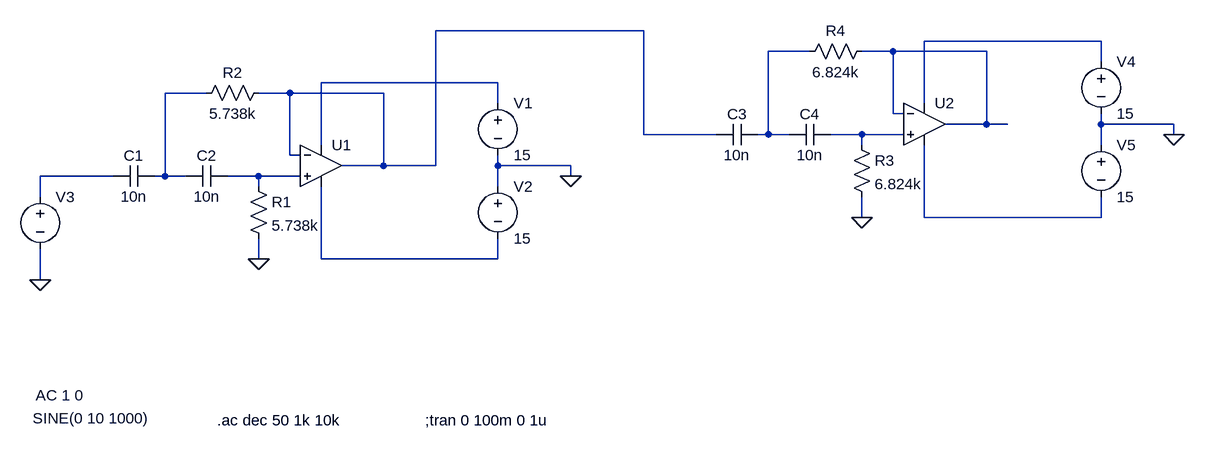
[diagram p0: schematic PA_teste.asc]
PA_teste.asc, the LTspice schematic file:
Version 4
SHEET 1 1556 680
WIRE 720 -32 400 -32
WIRE 1424 -16 1152 -16
WIRE 976 0 912 0
WIRE 1104 0 1056 0
WIRE 1248 0 1104 0
WIRE 1424 16 1424 -16
WIRE 496 48 224 48
WIRE 48 64 -16 64
WIRE 176 64 128 64
WIRE 320 64 176 64
WIRE 496 80 496 48
WIRE 1152 80 1152 -16
WIRE 1104 96 1104 0
WIRE 1120 96 1104 96
WIRE 1248 112 1248 0
WIRE 1248 112 1184 112
WIRE 1280 112 1248 112
WIRE 1424 112 1424 96
WIRE 1536 112 1424 112
WIRE 720 128 720 -32
WIRE 832 128 720 128
WIRE 912 128 912 0
WIRE 912 128 896 128
WIRE 944 128 912 128
WIRE 1056 128 1008 128
WIRE 1120 128 1056 128
WIRE 1536 128 1536 112
WIRE 224 144 224 48
WIRE 1056 144 1056 128
WIRE 1424 144 1424 112
WIRE 176 160 176 64
WIRE 192 160 176 160
WIRE 320 176 320 64
WIRE 320 176 256 176
WIRE 400 176 400 -32
WIRE 400 176 320 176
WIRE 496 176 496 160
WIRE 608 176 496 176
WIRE -96 192 -208 192
WIRE -16 192 -16 64
WIRE -16 192 -32 192
WIRE 16 192 -16 192
WIRE 128 192 80 192
WIRE 192 192 128 192
WIRE 608 192 608 176
WIRE 128 208 128 192
WIRE 496 208 496 176
WIRE -208 224 -208 192
WIRE 1056 256 1056 224
WIRE 1152 256 1152 144
WIRE 1424 256 1424 224
WIRE 1424 256 1152 256
WIRE 128 320 128 288
WIRE 224 320 224 208
WIRE 496 320 496 288
WIRE 496 320 224 320
WIRE -208 352 -208 304
FLAG 128 320 0
FLAG 608 192 0
FLAG -208 352 0
FLAG 1056 256 0
FLAG 1536 128 0
SYMBOL OpAmps\\UniversalOpAmp 224 176 R0
SYMATTR InstName U1
SYMBOL cap -32 176 R90
WINDOW 0 0 32 VBottom 2
WINDOW 3 32 32 VTop 2
SYMATTR InstName C1
SYMATTR Value 10n
SYMBOL cap 80 176 R90
WINDOW 0 0 32 VBottom 2
WINDOW 3 32 32 VTop 2
SYMATTR InstName C2
SYMATTR Value 10n
SYMBOL res 112 192 R0
SYMATTR InstName R1
SYMATTR Value 5.738k
SYMBOL res 144 48 R90
WINDOW 0 0 56 VBottom 2
WINDOW 3 32 56 VTop 2
SYMATTR InstName R2
SYMATTR Value 5.738k
SYMBOL voltage 496 64 R0
WINDOW 123 0 0 Left 0
WINDOW 39 0 0 Left 0
SYMATTR InstName V1
SYMATTR Value 15
SYMBOL voltage 496 192 R0
WINDOW 123 0 0 Left 0
WINDOW 39 0 0 Left 0
SYMATTR InstName V2
SYMATTR Value 15
SYMBOL voltage -208 208 R0
WINDOW 3 -12 357 Left 2
WINDOW 123 -7 322 Left 2
WINDOW 39 0 0 Left 0
SYMATTR Value SINE(0 10 1000)
SYMATTR Value2 AC 1 0
SYMATTR InstName V3
SYMBOL OpAmps\\UniversalOpAmp 1152 112 R0
SYMATTR InstName U2
SYMBOL cap 896 112 R90
WINDOW 0 0 32 VBottom 2
WINDOW 3 32 32 VTop 2
SYMATTR InstName C3
SYMATTR Value 10n
SYMBOL cap 1008 112 R90
WINDOW 0 0 32 VBottom 2
WINDOW 3 32 32 VTop 2
SYMATTR InstName C4
SYMATTR Value 10n
SYMBOL res 1040 128 R0
SYMATTR InstName R3
SYMATTR Value 6.824k
SYMBOL res 1072 -16 R90
WINDOW 0 0 56 VBottom 2
WINDOW 3 32 56 VTop 2
SYMATTR InstName R4
SYMATTR Value 6.824k
SYMBOL voltage 1424 0 R0
WINDOW 123 0 0 Left 0
WINDOW 39 0 0 Left 0
SYMATTR InstName V4
SYMATTR Value 15
SYMBOL voltage 1424 128 R0
WINDOW 123 0 0 Left 0
WINDOW 39 0 0 Left 0
SYMATTR InstName V5
SYMATTR Value 15
TEXT 384 568 Left 2 !;tran 0 100m 0 1u
TEXT 64 568 Left 2 !.ac dec 50 1k 10k

The netlist it stands for:
* PA_teste.asc
XU1 N009 N001 N005 N011 N001 level1 Avol=1Meg GBW=10Meg Vos=0 En=0 Enk=0 In=0 Ink=0 Rin=500Meg  ; pins In+ In- V+ V- OUT
C1 N006 N008 10n
C2 N009 N006 10n
R1 N009 0 5.738k
R2 N001 N006 5.738k
V1 N005 0 15
V2 0 N011 15
V3 N008 0 SINE(0 10 1000) AC 1 0
XU2 N007 N004 N002 N010 N004 level1 Avol=1Meg GBW=10Meg Vos=0 En=0 Enk=0 In=0 Ink=0 Rin=500Meg  ; pins In+ In- V+ V- OUT
C3 N003 N001 10n
C4 N007 N003 10n
R3 N007 0 6.824k
R4 N004 N003 6.824k
V4 N002 0 15
V5 0 N010 15
;tran 0 100m 0 1u
.ac dec 50 1k 10k
.lib UniversalOpAmp1.lib
.backanno
.end